# Altium schematic sheet STeaMi-FP6-Microcontroleur.SchDoc
size A3; DocumentNumber: 1; SheetNumber: 7; SheetTotal: 16
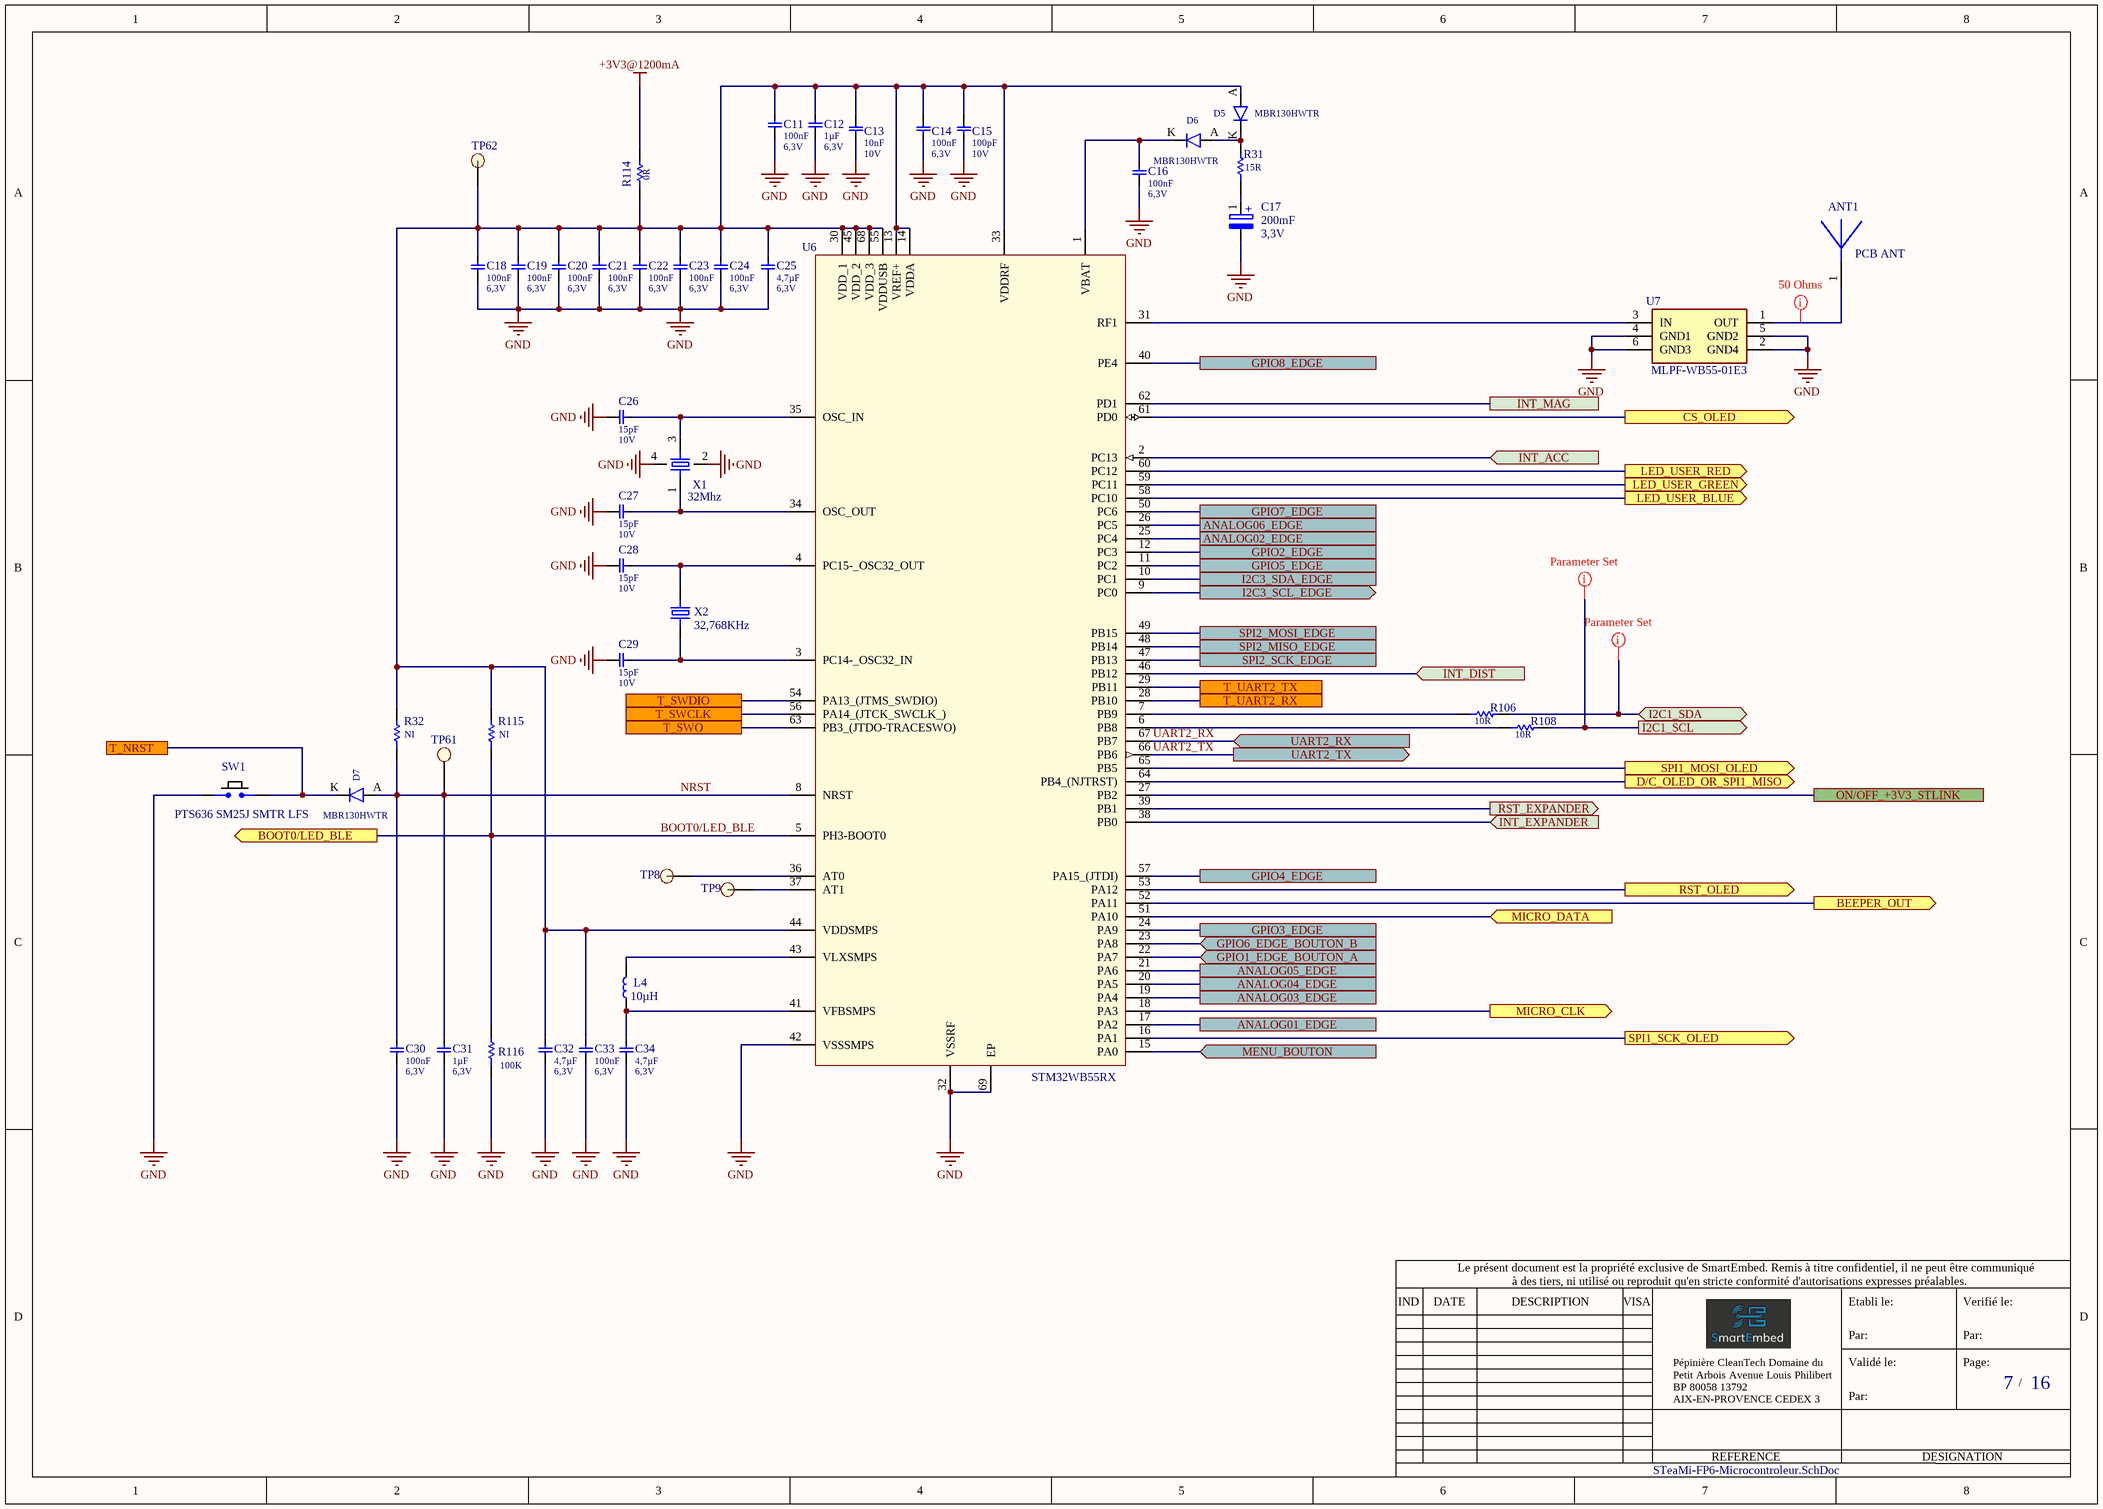
[diagram p0: STeaMi-FP6-Microcontroleur.SchDoc]

## Parts
ANT1  PCB ANT  [PCB_ANT]  (no BOM)
C11  Capacitance: 100nF  Voltage: 6,3V  [0402-CAP]
C12  Capacitance: 1µF  Voltage: 6,3V  [0402-CAP]
C13  Capacitance: 10nF  Voltage: 10V  [0402-CAP]
C14  Capacitance: 100nF  Voltage: 6,3V  [0402-CAP]
C15  Capacitance: 100pF  Voltage: 10V  [0402-CAP]
C16  Capacitance: 100nF  Voltage: 6,3V  [0402-CAP]
C17  Capacitance: 200mF  Voltage: 3,3V  [DSK3R3H204T614]
C18  Capacitance: 100nF  Voltage: 6,3V  [0402-CAP]
C19  Capacitance: 100nF  Voltage: 6,3V  [0402-CAP]
C20  Capacitance: 100nF  Voltage: 6,3V  [0402-CAP]
C21  Capacitance: 100nF  Voltage: 6,3V  [0402-CAP]
C22  Capacitance: 100nF  Voltage: 6,3V  [0402-CAP]
C23  Capacitance: 100nF  Voltage: 6,3V  [0402-CAP]
C24  Capacitance: 100nF  Voltage: 6,3V  [0402-CAP]
C25  Capacitance: 4,7µF  Voltage: 6,3V  [0402-CAP]
C26  Capacitance: 15pF  Voltage: 10V  [0402-CAP]
C27  Capacitance: 15pF  Voltage: 10V  [0402-CAP]
C28  Capacitance: 15pF  Voltage: 10V  [0402-CAP]
C29  Capacitance: 15pF  Voltage: 10V  [0402-CAP]
C30  Capacitance: 100nF  Voltage: 6,3V  [0402-CAP]
C31  Capacitance: 1µF  Voltage: 6,3V  [0402-CAP]
C32  Capacitance: 4,7µF  Voltage: 6,3V  [0402-CAP]
C33  Capacitance: 100nF  Voltage: 6,3V  [0402-CAP]
C34  Capacitance: 4,7µF  Voltage: 6,3V  [0402-CAP]
D5  Part Number: MBR130HWTR  [SOD3615X145N_SOD123]
D6  Part Number: MBR130HWTR  [SOD3615X145N_SOD123]
D7  Part Number: MBR130HWTR  [SOD3615X145N_SOD123]
L4  Inductance: 10µH  [LQM21 SERIES]
R31  Resistance: 15R  [RESC3216X88N_1206]
R32  (no value)  [RESC1005X40N_0402]
R106  Resistance: 10R  [RESC1005X40N_0402]
R108  Resistance: 10R  [RESC1005X40N_0402]
R114  Resistance: 0R  [RESC1005X40N_0402]
R115  (no value)  [RESC1005X40N_0402]
R116  Resistance: 100K  [RESC1005X40N_0402]
SW1  Part Number: PTS636 SM25J SMTR LFS  [PTS636SM25FSMTRLFS]
TP8  PAD  [Testpoint 1mm]  (value not drawn)  (no BOM)
TP9  PAD  [Testpoint 1mm]  (value not drawn)  (no BOM)
TP61  PAD  [Testpoint 1mm]  (value not drawn)  (no BOM)
TP62  PAD  [Testpoint 1mm]  (value not drawn)  (no BOM)
U6  (no value)  [QFN40P800X800X100-69N-D]
U7  (no value)  [MLPFWB5501E3]
X1  Frequency: 32Mhz  [WE_XTAL_CFPX_180]
X2  Frequency: 32,768KHz  [WE_XTAL_IQXC-25]

## Ports
ANALOG01_EDGE, ANALOG02_EDGE, ANALOG03_EDGE, ANALOG04_EDGE, ANALOG05_EDGE, ANALOG06_EDGE, BEEPER_OUT (out), BOOT0/LED_BLE (out), CS_OLED (out), D/C_OLED_OR_SPI1_MISO (out), GPIO1_EDGE_BOUTON_A (in), GPIO2_EDGE, GPIO3_EDGE, GPIO4_EDGE, GPIO5_EDGE, GPIO6_EDGE_BOUTON_B (in), GPIO7_EDGE, GPIO8_EDGE, I2C1_SCL (out), I2C1_SDA (bidir), I2C3_SCL_EDGE (out), I2C3_SDA_EDGE, INT_ACC (in), INT_DIST (in), INT_EXPANDER (in), INT_MAG, LED_USER_BLUE (out), LED_USER_GREEN (out), LED_USER_RED (out), MENU_BOUTON (in), MICRO_CLK (out), MICRO_DATA (in), ON/OFF_+3V3_STLINK, RST_EXPANDER (out), RST_OLED (out), SPI1_MOSI_OLED (out), SPI1_SCK_OLED (out), SPI2_MISO_EDGE, SPI2_MOSI_EDGE, SPI2_SCK_EDGE, T_NRST, T_SWCLK, T_SWDIO, T_SWO, T_UART2_RX, T_UART2_TX, UART2_RX (in), UART2_TX (out)

## Nets
+3V3@1200mA: R114.2
GND: C11.1 C12.1 C13.2 C14.2 C15.2 C16.1 C17.2 C18.1 C19.1 C20.1 C21.1 C22.1 C23.1 C24.1 C25.1 C26.1 C27.1 C28.1 C29.1 C30.1 C31.1 C32.1 C33.1 C34.1 R116.1 SW1.2 U6.32(VSSRF) U6.42(VSSSMPS) U6.69(EP) U7.2(GND4) U7.4(GND1) U7.5(GND2) U7.6(GND3) X1.2(GND) X1.4(GND)
ANALOG01_EDGE: U6.17(PA2) ; port ANALOG01_EDGE
ANALOG02_EDGE: U6.25(PC4) ; port ANALOG02_EDGE
ANALOG03_EDGE: U6.19(PA4) ; port ANALOG03_EDGE
ANALOG04_EDGE: U6.20(PA5) ; port ANALOG04_EDGE
ANALOG05_EDGE: U6.21(PA6) ; port ANALOG05_EDGE
ANALOG06_EDGE: U6.26(PC5) ; port ANALOG06_EDGE
BEEPER_OUT: U6.52(PA11) ; port BEEPER_OUT
BOOT0/LED_BLE: R115.1 R116.2 U6.5(PH3-BOOT0) ; port BOOT0/LED_BLE
CS_OLED: U6.61(PD0) ; port CS_OLED
D/C_OLED_OR_SPI1_MISO: U6.64(PB4_(NJTRST)) ; port D/C_OLED_OR_SPI1_MISO
GPIO1_EDGE_BOUTON_A: U6.22(PA7) ; port GPIO1_EDGE_BOUTON_A
GPIO2_EDGE: U6.12(PC3) ; port GPIO2_EDGE
GPIO3_EDGE: U6.24(PA9) ; port GPIO3_EDGE
GPIO4_EDGE: U6.57(PA15_(JTDI)) ; port GPIO4_EDGE
GPIO5_EDGE: U6.11(PC2) ; port GPIO5_EDGE
GPIO6_EDGE_BOUTON_B: U6.23(PA8) ; port GPIO6_EDGE_BOUTON_B
GPIO7_EDGE: U6.50(PC6) ; port GPIO7_EDGE
GPIO8_EDGE: U6.40(PE4) ; port GPIO8_EDGE
I2C1_SCL: R108.2 ; port I2C1_SCL
I2C1_SDA: R106.2 ; port I2C1_SDA
I2C3_SCL_EDGE: U6.9(PC0) ; port I2C3_SCL_EDGE
I2C3_SDA_EDGE: U6.10(PC1) ; port I2C3_SDA_EDGE
INT_ACC: U6.2(PC13) ; port INT_ACC
INT_DIST: U6.46(PB12) ; port INT_DIST
INT_EXPANDER: U6.38(PB0) ; port INT_EXPANDER
INT_MAG: U6.62(PD1) ; port INT_MAG
LED_USER_BLUE: U6.58(PC10) ; port LED_USER_BLUE
LED_USER_GREEN: U6.59(PC11) ; port LED_USER_GREEN
LED_USER_RED: U6.60(PC12) ; port LED_USER_RED
MENU_BOUTON: U6.15(PA0) ; port MENU_BOUTON
MICRO_CLK: U6.18(PA3) ; port MICRO_CLK
MICRO_DATA: U6.51(PA10) ; port MICRO_DATA
NRST: C30.2 C31.2 D7.A R32.1 TP61.1 U6.8(NRST)
ON/OFF_+3V3_STLINK: U6.27(PB2) ; port ON/OFF_+3V3_STLINK
RST_EXPANDER: U6.39(PB1) ; port RST_EXPANDER
RST_OLED: U6.53(PA12) ; port RST_OLED
SPI1_MOSI_OLED: U6.65(PB5) ; port SPI1_MOSI_OLED
SPI1_SCK_OLED: U6.16(PA1) ; port SPI1_SCK_OLED
SPI2_MISO_EDGE: U6.48(PB14) ; port SPI2_MISO_EDGE
SPI2_MOSI_EDGE: U6.49(PB15) ; port SPI2_MOSI_EDGE
SPI2_SCK_EDGE: U6.47(PB13) ; port SPI2_SCK_EDGE
T_NRST: D7.K SW1.1 ; port T_NRST
T_SWCLK: U6.56(PA14_(JTCK_SWCLK_)) ; port T_SWCLK
T_SWDIO: U6.54(PA13_(JTMS_SWDIO)) ; port T_SWDIO
T_SWO: U6.63(PB3_(JTDO-TRACESWO)) ; port T_SWO
T_UART2_RX: U6.28(PB10) ; port T_UART2_RX
T_UART2_TX: U6.29(PB11) ; port T_UART2_TX
UART2_RX: U6.67(PB7) ; port UART2_RX
UART2_TX: U6.66(PB6) ; port UART2_TX
NetANT1_1: ANT1.1(FEED) U7.1(OUT)
NetC11_2: C11.2 C12.2 C13.1 C14.1 C15.1 C18.2 C19.2 C20.2 C21.2 C22.2 C23.2 C24.2 C25.2 C32.2 C33.2 D5.A R32.2 R114.1 R115.2 TP62.1 U6.13(VREF+) U6.14(VDDA) U6.30(VDD_1) U6.33(VDDRF) U6.44(VDDSMPS) U6.45(VDD_2) U6.55(VDDUSB) U6.68(VDD_3)
NetC16_2: C16.2 D6.K U6.1(VBAT)
NetC17_1: C17.1 R31.1
NetC26_2: C26.2 U6.35(OSC_IN) X1.3(IN/OUT)
NetC27_2: C27.2 U6.34(OSC_OUT) X1.1(IN/OUT)
NetC28_2: C28.2 U6.4(PC15-_OSC32_OUT) X2.2
NetC29_2: C29.2 U6.3(PC14-_OSC32_IN) X2.1
NetC34_2: C34.2 L4.1 U6.41(VFBSMPS)
NetD5_K: D5.K D6.A R31.2
NetL4_2: L4.2 U6.43(VLXSMPS)
NetR106_1: R106.1 U6.7(PB9)
NetR108_1: R108.1 U6.6(PB8)
NetTP8_1: TP8.1 U6.36(AT0)
NetTP9_1: TP9.1 U6.37(AT1)
NetU6_31: U6.31(RF1) U7.3(IN)

## Layout directives
rule Clearance Constraint [Clearance = 0.2mm]: NetANT1_1
rule Clearance Constraint [Generic clearance = 0.16mm, and 11 value(s) for objects]: I2C1_SCL, I2C1_SDA

## Notes on the sheet
- Le présent document est la propriété exclusive de SmartEmbed. Remis à titre confidentiel, il ne peut être communiqué
- IND
- DATE
- DESCRIPTION
- VISA
- à des tiers, ni utilisé ou reproduit qu'en stricte conformité d'autorisations expresses préalables.
- Etabli le:
- Verifié le:
- Validé le:
- Par:
- Page:
- /
- Pépinière CleanTech Domaine du Petit Arbois Avenue Louis Philibert BP 80058 13792 AIX-EN-PROVENCE CEDEX 3
- REFERENCE
- DESIGNATION
- (in symbol 200mF-20%-3,3V-Supercap-6,8X11,7x1,8) +

## Library data of the parts
ANT1 = PCB_ANT: PCB ANTENAL; Populated: True; Switch possibility: Non; Created by: EAG; Creation Date: 13/10/2021; Manufacturer: N/A; Manufacturer Part Number: N/A; Part Number: PCB_ANT; Vérification: Non
C11 C14 C16 C18-C24 C30 C33 = 100nF-10%-6,3V-X5R-0402: CAP CER 100nF 6,3V X5R 0402; Manufacturer: Kyocera AVX; Manufacturer Part Number: 0402YD104KAT2A; Populated: True; std Package: 0402; Tolerence: 0,1; Vérification: Non; Created by: EAG; Creation Date: 18/10/2021; Checked by: *; Part Number: 100nF-10%-6,3V-X5R-0402; Dielectric: X5R; Digikey: 478-1126-1-ND; Mouser: 581-0402YD104K; Switch possibility: True
C12 C31 = 1µF-10%-6,3V-X5R-0402: CAP CER 1µF 6,3V X5R 0402; Manufacturer: Taiyo Yuden; Manufacturer Part Number: JMK105BJ105KV-F; Populated: True; std Package: 0402; Tolerence: 0,1; Vérification: Non; Created by: EAG; Creation Date: 08/04/2021; Checked by: *; Part Number: 1µF-10%-6,3V-X5R-0402; Dielectric: X5R; Mouser: 963-JMK105BJ105KV-F; Switch possibility: True
C13 = 10nF-10%-10V-X7R-0402: CAP CER 10nF 10V X7R 0402; Manufacturer: AVX; Manufacturer Part Number: 0402ZC103KAT2A; Populated: True; std Package: 0402; Tolerence: 0,1; Vérification: Non; Created by: EAG; Creation Date: 01/04/2021; Checked by: *; Part Number: 10nF-10%-10V-X7R-0402; Dielectric: X7R; Mouser: 581-0402ZC103KAT2A; Switch possibility: True
C15 = 100pF-10%-10V-X7R-0402: CAP CER 100pF 10V X7R 0402; Manufacturer: WURTH Electronics; Manufacturer Part Number: 885012205001; Populated: True; std Package: 0402; Tolerence: 0,1; Vérification: Non; Created by: EAG; Creation Date: 22/11/2021; Checked by: *; Part Number: 100pF-10%-10V-X7R-0402; Dielectric: X7R; Digikey: 732-7496-1-ND; Farnell: 2812288; Mouser: 710-885012205001; Switch possibility: True
C17 = 200mF-20%-3,3V-Supercap-6,8X11,7x1,8: CAP CER 200mF 3,3V Supercap 6,8X11,7x1,8; Manufacturer: Elna America; Manufacturer Part Number: DSK-3R3H204T614-H2L; Populated: True; Switch possibility: False; Tolerence: 0,2; Vérification: Non; Created by: EAG; Creation Date: 27/10/2021; Part Number: 200mF-20%-3,3V-Supercap-6,8X11,7x1,8; Dielectric: Supercap; Digikey: 604-1147-1-ND; Mouser: 555-DSK3R3H204T614H2; std Package: 6,8X11,7x1,8
C25 = 4,7µF-20%-6,3V-X5R-0402: CAP CER 4,7µF 6,3V X5R 0402; Manufacturer: Murata; Manufacturer Part Number: GRM155R60J475ME8D; Populated: True; std Package: 0402; Tolerence: 0,2; Vérification: Non; Created by: EAG; Creation Date: 01/04/2021; Checked by: *; Part Number: 4,7µF-20%-6,3V-X5R-0402; Dielectric: X5R; Digikey: 490-5408-6-ND; Mouser: 81-GRM155R60J475ME8D; Switch possibility: True
C26-C29 = 15pF-5%-10V-C0G-0402: CAP CER 15pF 10V C0G 0402; Manufacturer: KEMET; Manufacturer Part Number: C0402C150J8HACTU; Populated: True; std Package: 0402; Tolerence: 0,05; Vérification: Non; Created by: EAG; Creation Date: 29/11/2021; Checked by: *; Part Number: 15pF-5%-10V-C0G-0402; Dielectric: C0G; Farnell: 3784148; Mouser: 80-C0402C150J8HACTU; Switch possibility: True
C32 C34 = 4,7µF-20%-6,3V-X5R-0402: CAP CER 4,7µF 6,3V X5R 0402; Populated: True; std Package: 0402; Tolerence: 0,2; Vérification: Non; Created by: EAG; Creation Date: 01/04/2021; Checked by: *; Part Number: 4,7µF-20%-6,3V-X5R-0402; Dielectric: X5R; Digikey: 490-5408-6-ND; Mouser: 81-GRM155R60J475ME8D; Switch possibility: True
D5-D7 = MBR130HWTR: Diode Schottky 30 V 1A Montage en surface SOD-123; Manufacturer: SMC diode solutions; Populated: True; Switch possibility: False; Voltage: 30V; Vérification: Non; Created by: EAG; Creation Date: 18/12/2021; Manufacturer Part Number: MBR130HWTR; Digikey: 1655-1437-1-ND
L4 = 10µH-20%-0,1A-600mOhm: Fixed Inductor 10µH µH ± 20% 0,1A 0805; Manufacturer: Murata Electronics; Manufacturer Part Number: LQM21FN100M70L; Populated: True; DC Current: 0,1A; Switch possibility: False; Tolerence: 0,2; Vérification: Non; Created by: EAG; Creation Date: 10/10/2019; Part Number: 10µH-20%-0,1A-600mOhm; Mouser: 81-LQM21FN100M70L; Resistance: 600mOhm
R31 = 15R-0,5%-1W-1206: RES CMS 15R0,5%-1W-1206 ±0ppm/°C; Manufacturer: Susumu; Manufacturer Part Number: HRG3216Q-15R0-D-T1; Populated: True; Power: 1; Nom vérificateur: Non; Prix: 0,76; std Package: 1206; Tolerence: 0,005; Created by: EAG; Creation Date: 30/09/2021; Part Number: 15R-0,5%-1W-1206; Digikey: 408-1885-1-ND; Mouser: 754-HRG3216Q15R0DT1; Switch possibility: True
R32 R115 = NI-1%-0,1W-0603: NI; Populated: True; Power: 0,1; Nom vérificateur: Non; std Package: 0603; Tolerence: 0,01; Created by: MSA; Creation Date: 20/03/2019; Manufacturer: -; Manufacturer Part Number: -; Resistance: NI; Part Number: NI-1%-0,1W-0603; Digikey: -; Farnell: -; Mouser: -; RS: -; Switch possibility: True
R106 R108 = 10R-1%-0,0625W-0402: RES CMS 10R1%-0,0625W-0402 ±200ppm/°C; Manufacturer: Yageo; Manufacturer Part Number: RC0402FR-1010RL; Populated: True; Power: 0,0625; Nom vérificateur: Non; Prix: 0,08; std Package: 0402; Tolerence: 0,01; Created by: EAG; Creation Date: 29/01/2021; Part Number: 10R-1%-0,0625W-0402; Mouser: 603-RC0402FR-1010RL; Switch possibility: True
R114 = 0R-5%-0,0625W-0402: RES CMS 0R5%-0,0625W-0402; Manufacturer: Yageo; Manufacturer Part Number: RC0402JR-100RL; Populated: True; Power: 0,0625; Nom vérificateur: Non; Prix: 0,09; std Package: 0402; Tolerence: 0,05; Created by: EAG; Creation Date: 02/12/2021; Part Number: 0R-5%-0,0625W-0402; Mouser: 603-RC0402JR-100RL; Switch possibility: True
R116 = 100K-1%-0,063W-0402: RES CMS 100K1%-0,063W-0402 ±100ppm/°C; Manufacturer: TE Connectivity; Manufacturer Part Number: CRG0402F100K; Populated: True; Power: 0,063; Nom vérificateur: Non; Prix: 0,019; RS: 667-8977; std Package: 0402; Tolerence: 0,01; Created by: EAG; Creation Date: 22/04/2022; Part Number: 100K-1%-0,063W-0402; Switch possibility: True
SW1 = PTS636 SM25J SMTR LFS: Surface Mounting Switch; Manufacturer: C&K; Populated: True; Switch possibility: False; Vérification: Non; Created by: EAG; Creation Date: 29/09/2021; Manufacturer Part Number: PTS636 SM25J SMTR LFS; Checked by: *; Digikey: CKN12325-1-ND; Mouser: 611-PTS636SM25JSMTRL
TP8 TP9 TP61 TP62 = TESTPOINTPAD: Manufacturer: Smartembed; Switch possibility: False; Vérification: Non; Package: PAD_TEST; Part Number: TESTPOINTPAD; Created by: EAG; Creation Date: 11/03/2020; Digikey: -; Farnell: -; Manufacturer Part Number: TESTPOINT; Mouser: -; RS: -
U6 = STM32WB55RX: MCU 32bit, STM32WB55RX-M4, 256 Kb to 1Mb Flash 128 to 256kB SRAM 64MHz Bluetooth 5.2, VFQFPN68; Manufacturer: STMicroelectronics; Populated: False; Switch possibility: False; Vérification: Non; Created by: EAG; Creation Date: 27/08/2021; Checked by: *; Ambient Temperature: ='Ambient temp'; Storage temperature: ='Storage temp'; Current: *; RoHs compliant: ='Rohs'; Datasheet: ='Datasheet'; Manufacturer Part Number: STM32WB55RX; Part Number: STM32WB55RX; Mouser: 511-STM32WB55RCV6
U7 = MLPF-WB55-01E3: Centre 2,45GHz fréquence Passe-bas Filtres RF (Fréquence radio) 100MHz Bande passante 1,1dB 6-SMD, sans plomb; Manufacturer: STMicroelectronics; Populated: False; Switch possibility: False; Vérification: Non; Created by: EAG; Creation Date: 30/09/2021; Checked by: *; Ambient Temperature: ='Ambient temp'; Storage temperature: ='Storage temp'; Current: *; RoHs compliant: ='Rohs'; Datasheet: ='Datasheet'; Manufacturer Part Number: MLPF-WB55-01E3; Part Number: MLPF-WB55-01E3; Digikey: 497-19088-1-ND; Mouser: 511-MLPF-WB55-01E3
X1 = 830103552209: QUARTZ 32MHz 9pF 10 ppm; Manufacturer: Wurth; Populated: True; Switch possibility: False; Vérification: Non; Created by: EAG; Creation Date: 30/09/2021; Manufacturer Part Number: 830103552209; ComponentLink1Description: Datasheet; ComponentLink1URL: https://www.diodes.com/assets/Datasheets/FL.pdf; Part Number: 830103552209; Digikey: 1923-830103552209CT-ND; Mouser: 710-830103552209
X2 = 830062558: QUARTZ 32Khz 12pF 30 ppm; Manufacturer: Wurth; Populated: True; Switch possibility: False; Vérification: Non; Created by: EAG; Creation Date: 30/09/2021; Manufacturer Part Number: 830062558; Part Number: 830062558; Digikey: 732-830062558CT-ND; Mouser: 710-830062558